# EAGLE design noisemaker_3-0 (EAGLE 6.4)
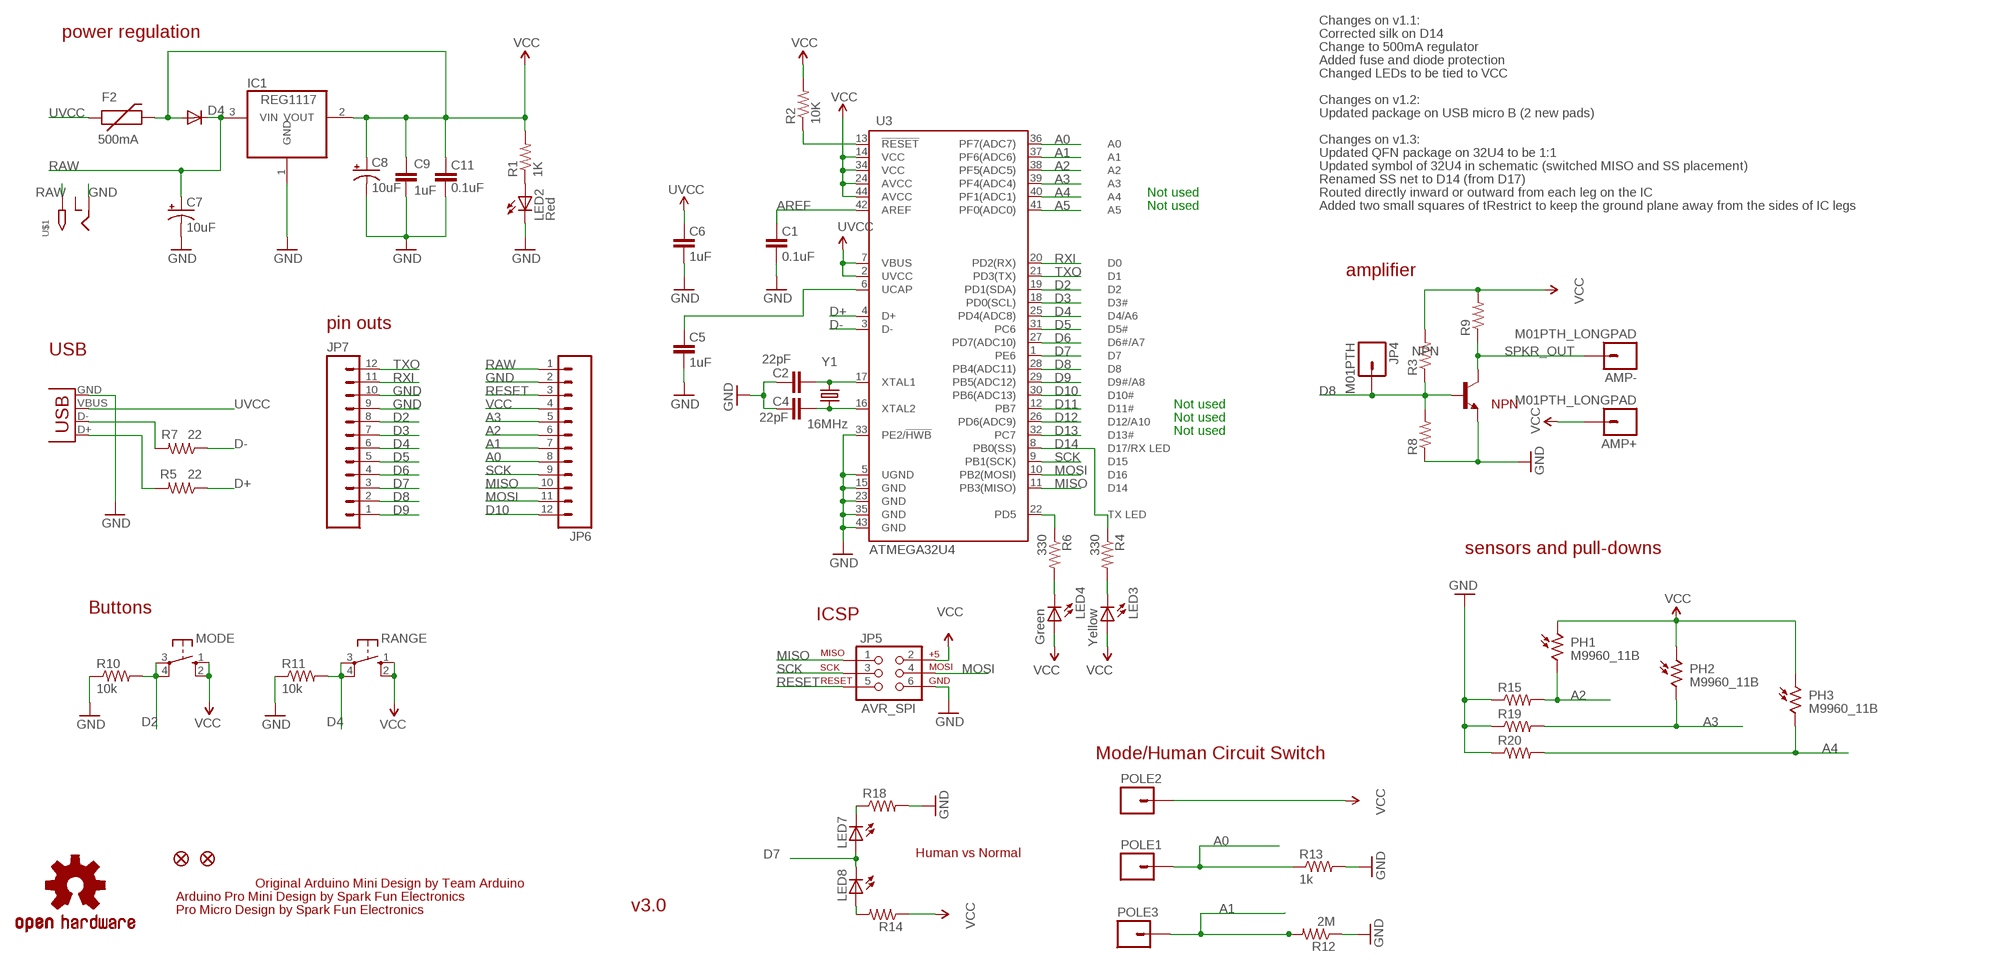
[diagram p0: schematic, sheet 1]

## Parts
AMP+  M01PTH_LONGPAD  [1X01_LONGPAD]
AMP-  M01PTH_LONGPAD  [1X01_LONGPAD]
C1  0.1uF  CAP1206  [1206]
C2  22pF  CAP0603-CAP  [0603-CAP]
C4  22pF  CAP0603-CAP  [0603-CAP]
C5  1uF  CAP1206  [1206]
C6  1uF  CAP1206  [1206]
C7  10uF  CAP_POL3528-KIT  [EIA3528-KIT]
C8  10uF  CAP_POL3528-KIT  [EIA3528-KIT]
C9  1uF  CAP1206  [1206]
C11  0.1uF  CAP1206  [1206]
D4  DIODESOD  [SOD-323]
F2  500mA  PTCSMD  [PTC-1206]
IC1  REG1117  [SOT223]
JP1  FIDUCIALUFIDUCIAL  [MICRO-FIDUCIAL]
JP2  FIDUCIALUFIDUCIAL  [MICRO-FIDUCIAL]
JP3  USB-B  USBPTH  [USB-B-PTH]
JP4  M01PTH  [1X01]
JP5  AVR_SPI  AVR_SPI_PRG_6PTH  [2X3]
JP6  M12PTH  [1X12]
JP7  M12PTH  [1X12]
LED2  Red  LEDCHIPLED_1206  [CHIPLED_1206]
LED3  Yellow  LEDCHIPLED_1206  [CHIPLED_1206]
LED4  Green  LEDCHIPLED_1206  [CHIPLED_1206]
LED7  LED3MM  [LED3MM]
LED8  LED3MM  [LED3MM]
MODE  10-XX  [B3F-10XX]
NPN  -NPN-TO220V  [TO220V]
PH1  M9960_11B  [M9960]
PH2  M9960_11B  [M9960]
PH3  M9960_11B  [M9960]
POLE1  M01PTH_LONGPAD  [1X01_LONGPAD]
POLE2  M01PTH_LONGPAD  [1X01_LONGPAD]
POLE3  M01PTH_LONGPAD  [1X01_LONGPAD]
R1  1K  RESISTOR1206  [1206]
R2  10K  RESISTOR1206  [1206]
R3  RESISTOR1206  [1206]
R4  330  RESISTOR1206  [1206]
R5  22  RESISTOR1206  [1206]
R6  330  RESISTOR1206  [1206]
R7  22  RESISTOR1206  [1206]
R8  RESISTOR1206  [1206]
R9  RESISTOR1206  [1206]
R10  10k  RESISTOR1206  [1206]
R11  10k  RESISTOR1206  [1206]
R12  2M  RESISTOR1206  [1206]
R13  1k  RESISTOR1206  [1206]
R14  RESISTOR1206  [1206]
R15  RESISTOR1206  [1206]
R18  RESISTOR1206  [1206]
R19  RESISTOR1206  [1206]
R20  RESISTOR1206  [1206]
RANGE  10-XX  [B3F-10XX]
U3  ATMEGA32U4  ATMEGA32U4TQFP  [SPARKFUN-DIGITALIC_TQFP44]
U$1  2.1MMJACKTHM  [PJ-102A]
U$3  OSHW-LOGOS  [OSHW-LOGO-S]
Y1  16MHz  CRYSTAL5X3  [CRYSTAL-SMD-5X3]

## Nets
A0: JP6.8 POLE1.1 R13.1 U3.36(PF7(ADC7))
A1: JP6.7 POLE3.1 R12.2 U3.37(PF6(ADC6))
A2: JP6.6 PH1.2 R15.2 U3.38(PF5(ADC5))
A3: JP6.5 PH2.2 R19.2 U3.39(PF4(ADC4))
A4: PH3.2 R20.2 U3.40(PF1(ADC1))
A5: U3.41(PF0(ADC0))
AREF: C1.2 U3.42(AREF)
D2: JP7.8 MODE.3(P) MODE.4(P1) R10.2 U3.19(PD1(SDA))
D3: JP7.7 U3.18(PD0(SCL))
D4: JP7.6 R11.2 RANGE.3(P) RANGE.4(P1) U3.25(PD4(ADC8))
D5: JP7.5 U3.31(PC6)
D6: JP7.4 U3.27(PD7(ADC10))
D7: JP7.3 LED7.A LED8.K(C) U3.1(PE6)
D8: JP4.1 JP7.2 NPN.1(B) R3.1 R8.2 U3.28(PB4(ADC11))
D9: JP7.1 U3.29(PB5(ADC12))
D10: JP6.12 U3.30(PB6(ADC13))
D11: U3.12(PB7)
D12: U3.26(PD6(ADC9))
D13: U3.32(PC7)
D14: R4.1 U3.8(PB0(SS))
D+: R5.1 U3.4(D+)
D-: R7.1 U3.3(D-)
GND [vcc]: C1.1 C2.2 C4.2 C5.1 C6.1 C7.C(-) C8.C(-) C9.2 C11.1 IC1.1(GND) JP3.GND JP5.6 JP6.2 JP7.9 JP7.10 LED2.C NPN.3(E) R8.1 R10.1 R11.1 R12.1 R13.2 R15.1 R18.2 R19.1 R20.1 U3.5(UGND) U3.15(GND) U3.23(GND) U3.33(PE2/!HWB) U3.35(GND) U3.43(GND) U$1.RING
MISO: JP5.1 JP6.10 U3.11(PB3(MISO))
MOSI: JP5.4 JP6.11 U3.10(PB2(MOSI))
N$1: C4.1 U3.16(XTAL2) Y1.1
N$2: C2.1 U3.17(XTAL1) Y1.3
N$4: C5.2 U3.6(UCAP)
N$5: LED3.C R4.2
N$7: LED4.C R6.2
N$8: JP3.D+ R5.2
N$9: JP3.D- R7.2
N$10: LED2.A R1.1
N$12: LED7.K(C) R18.1
N$13: LED8.A R14.2
RAW [vcc]: C7.A(+) D4.1(C) IC1.3(VIN) JP6.1 U$1.TIP
RESET: JP5.5 JP6.3 R2.1 U3.13(!RESET)
RXI: JP7.11 U3.20(PD2(RX))
SCK: JP5.3 JP6.9 U3.9(PB1(SCK))
SPKR_OUT: AMP-.1 NPN.2(C) R9.1
TXLED: R6.1 U3.22(PD5)
TXO: JP7.12 U3.21(PD3(TX))
UVCC: C6.2 F2.1 JP3.VBUS U3.2(UVCC) U3.7(VBUS)
VCC: AMP+.1 C8.A(+) C9.1 C11.2 D4.2(A) F2.2 IC1.2(VOUT) JP5.2 JP6.4 LED3.A LED4.A MODE.1(S) MODE.2(S1) PH1.1 PH2.1 PH3.1 POLE2.1 R1.2 R2.2 R3.2 R9.2 R14.1 RANGE.1(S) RANGE.2(S1) U3.14(VCC) U3.24(AVCC) U3.34(VCC) U3.44(AVCC)
Unconnected: U$1.RING_SW

## Notes on the sheet
- Changes on v1.1:
- power regulation | Corrected silk on D14
- Change to 500mA regulator
- Added fuse and diode protection
- Changed LEDs to be tied to VCC
- Changes on v1.2:
- Updated package on USB micro B (2 new pads)
- Changes on v1.3:
- Updated QFN package on 32U4 to be 1:1
- Updated symbol of 32U4 in schematic (switched MISO and SS placement)
- Renamed SS net to D14 (from D17)
- Not used | Routed directly inward or outward from each leg on the IC
- Not used | Added two small squares of tRestrict to keep the ground plane away from the sides of IC legs
- amplifier
- pin outs
- USB
- Not used | NPN
- Not used
- Not used
- sensors and pull-downs
- Buttons
- ICSP
- Mode/Human Circuit Switch
- Human vs Normal
- Original Arduino Mini Design by Team Arduino
- Arduino Pro Mini Design by Spark Fun Electronics
- Pro Micro Design by Spark Fun Electronics | v3.0

## Library data of the parts
AMP+ AMP- JP4 POLE1-POLE3 = SparkFun-Connectors:M01: Header 1 Standard 1-pin 0.1" header. Use with straight break away headers (SKU : PRT-00116), right angle break away headers (PRT-00553), swiss pins (PRT-00743), machine pins (PRT-00117), and female headers (PRT-00115).
C1 C5 C6 C9 C11 = SparkFun-Capacitors:CAP: Capacitor Standard 0603 ceramic capacitor, and 0.1" leaded capacitor.
C2 C4 = SparkFun:CAP: Capacitor Standard 0603 ceramic capacitor, and 0.1" leaded capacitor.
C7 C8 = SparkFun-Capacitors:CAP_POL: Capacitor Polarized These are standard SMD and PTH capacitors. Normally 10uF, 47uF, and 100uF in electrolytic and tantalum varieties. Always verify the external diameter of the through hole cap, it varies with capacity, voltage, and manufacturer. The EIA devices should be standard.
D4 = SparkFun:DIODE: Diode These are standard reverse protection diodes and small signal diodes. SMA package can handle up to about 1A. SOD-323 can handle about 200mA. What the SOD-323 package when ordering, there are some mfgs out there that are 5-pin packages.
F2 = SparkFun:PTC: Resettable Fuse PTC Resettable Fuse. Spark Fun Electronics SKU : COM-08357
IC1 = burr-brown:REG1117: 800mA and 1A Low Dropout (LDO) Positive Regulator 1.8V, 2.5V, 2.85V, 3.3V, 5V, and Adj; MPN: REG1117; OC_FARNELL: 1097566; OC_NEWARK: 14P6981
JP1 JP2 = SparkFun:FIDUCIAL: Fiducial Alignment Points Various fiducial points for machine vision alignment.
JP3 = SparkFun-Connectors:USB: USB Connectors USB-B-PTH is fully proven SKU : PRT-00139/CONN-08278 USB-miniB is fully proven SKU : PRT-00587 USB-A-PCB is untested. USB-A-H is throughly reviewed, but untested. Spark Fun Electronics SKU : PRT-00437 USB-B-SMT is throughly reviewed, but untested. Needs silkscreen touching up. USB-A-S has not been used/tested USB-MB-H has not been used/tested USB-MICROB has been used. CONN-09505; PROD_ID: CONN-08278
JP5 = SparkFun:AVR_SPI_PRG_6: AVR ISP 6 Pin This is the reduced ISP connector for AVR programming. Common on Arduino. This footprint will take up less PCB space and can be used with a 10-pin to 6-pin adapter such as SKU: BOB-08508
JP6 JP7 = SparkFun:M12: Header 12 Standard 12-pin 0.1" header. Use with straight break away headers (SKU : PRT-00116), right angle break away headers (PRT-00553), swiss pins (PRT-00743), machine pins (PRT-00117), and female headers (PRT-00115).
LED2-LED4 LED7 LED8 = adafruit:LED: LED OSRAM: - CHIPLED LG R971, LG N971, LY N971, LG Q971, LY Q971, LO R971, LY R971 LH N974, LH R974 LS Q976, LO Q976, LY Q976 LO Q996 - Hyper CHIPLED LW Q18S LB Q993, LB Q99A, LB R99A - SideLED LS A670, LO A670, LY A670, LG A670, LP A670 LB A673, LV A673, LT A673, LW A673 LH A674 LY A675 LS A676, LA A676, LO A676, LY A676, LW A676 LS A679, LY A679, LG A679 - Hyper Micro SIDELED® LS Y876, LA Y876, LO Y876, LY Y876 LT Y87S - SmartLED LW L88C, LW L88S LB L89C, LB L89S, LG L890 LS L89K, LO L89K, LY L89K LS L896, LA L896, LO L896, LY L896 - TOPLED LS T670, LO T670, LY T670, LG T670, LP T670 LSG T670, LSP T670, LSY T670, LOP T670, LYG T670 LG T671, LOG T671, LSG T671 LB T673, LV T673, LT T673, LW T673 LH T674 LS T676, LA T676, LO T676, LY T676, LB T676, LH T676, LSB T676, LW T676 LB T67C, LV T67C, LT T67C, LS T67K, LO T67K, LY T67K, LW E67C LS E67B, LA E67B, LO E67B, LY E67B, LB E67C, LV E67C, LT E67C LW T67C LS T679, LY T679, LG T679 LS T770, LO T770, LY T770, LG T770, LP T770 LB T773, LV T773, LT T773, LW T773 LH T774 LS E675, LA E675, LY E675, LS T675 LS T776, LA T776, LO T776, LY T776, LB T776 LHGB T686 LT T68C, LB T68C - Hyper Mini TOPLED® LB M676 - Mini TOPLED Santana® LG M470 LS M47K, LO M47K, LY M47K Source: http://www.osram.convergy.de/
MODE RANGE = switch-omron:10-XX: OMRON SWITCH
NPN = transistor:*-NPN-: NPN Transistror BF959 corrected 2008.03.06
PH1-PH3 = photo-elements:M9960_11: Photo Sensor Beacon Light, Photometer Applications Source: http://optoelectronics.perkinelmer.com/content/Datasheets/DTS_M9960.pdf
R1-R15 R18-R20 = SparkFun-Passives:RESISTOR: Resistor Basic schematic elements and footprints for 0603, 1206, and PTH resistors.
U3 = SparkFun-DigitalIC:ATMEGA32U4: Atmel 44-pin 8-bit Microcontroller with 32KBytes of ISP Flash and USB Controller
U$1 = adafruit:2.1MMJACK: 2.1mm x 5.5mm THM DC jack with internal switch. Digikey part #PJ-102A, 4UCON part #05537 2.1mm x 5.5mm SMT DC jack with internal switch. Digikey part #PJ-002A-SMT, 4UCON part #03267 By microbuilder.eu & adafruit.com
U$3 = SparkFun:OSHW-LOGO: Open Source Hardware Logo This logo indicates the piece of hardware it is found on incorporates a OSHW license and/or adheres to the definition of open source hardware found here: http://freedomdefined.org/OSHW
Y1 = SparkFun:CRYSTAL: Crystals Various standard crystals. Proven footprints. Spark Fun Electronics SKU : COM-00534

## Net classes
0 default: width 0.203 mm

## Board
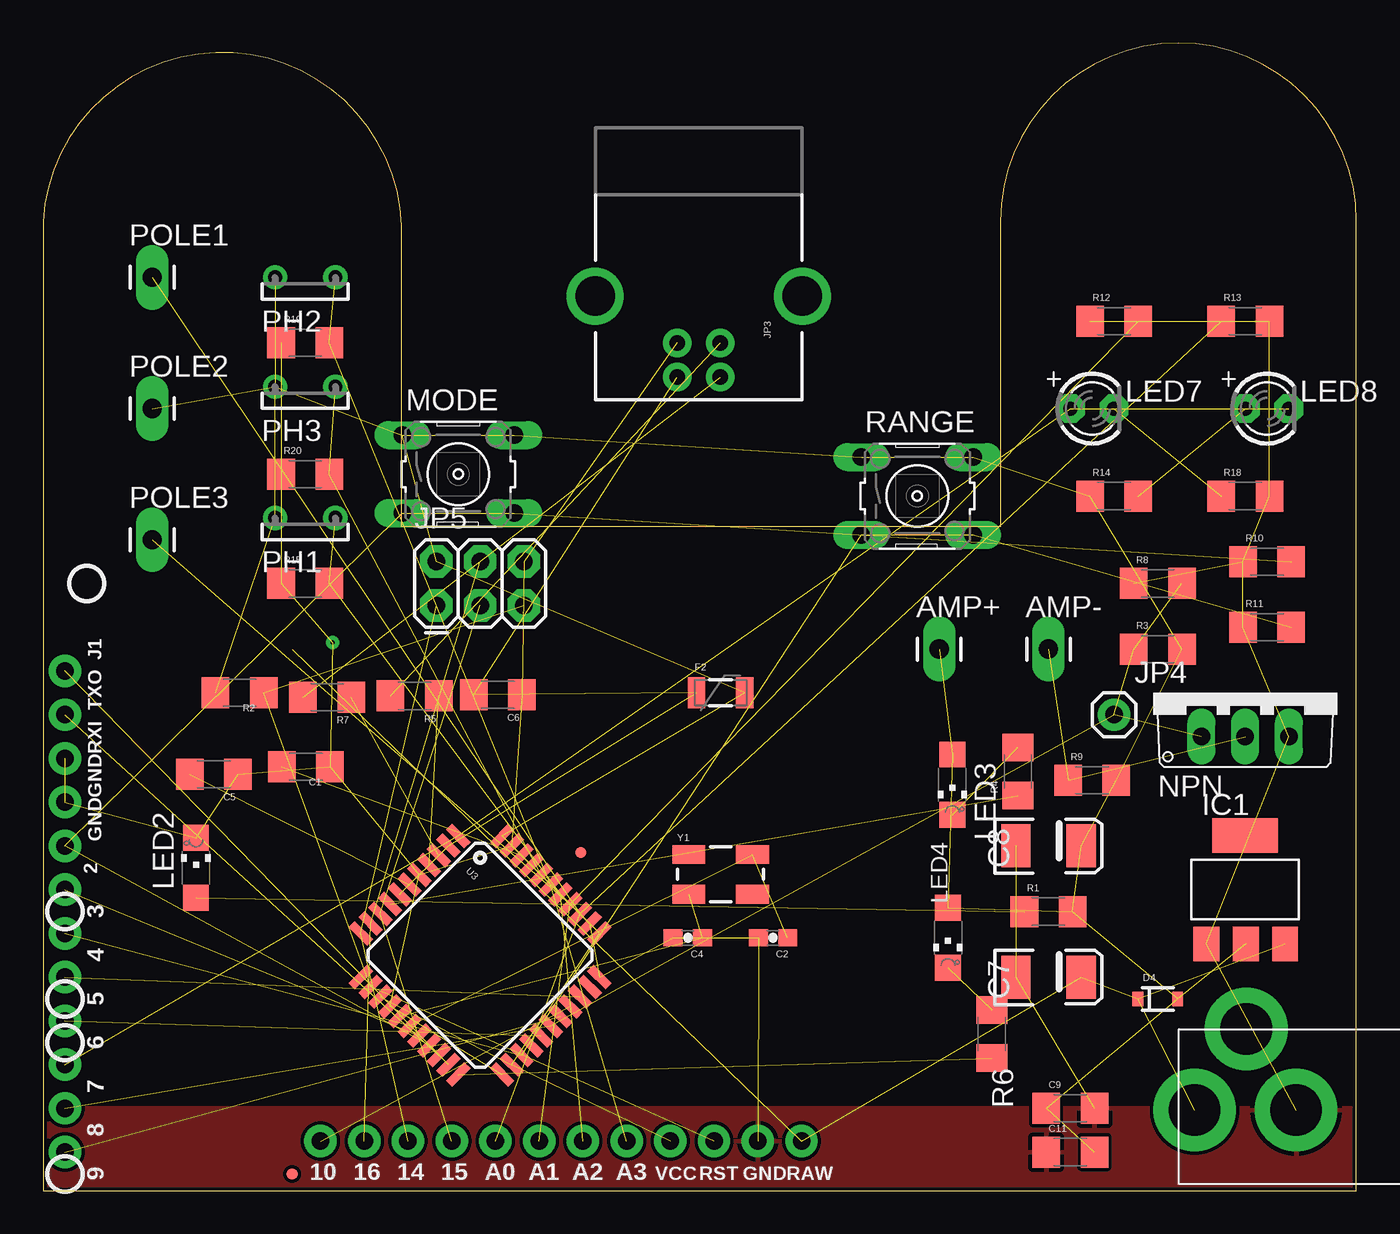
[diagram p1: board, top side]
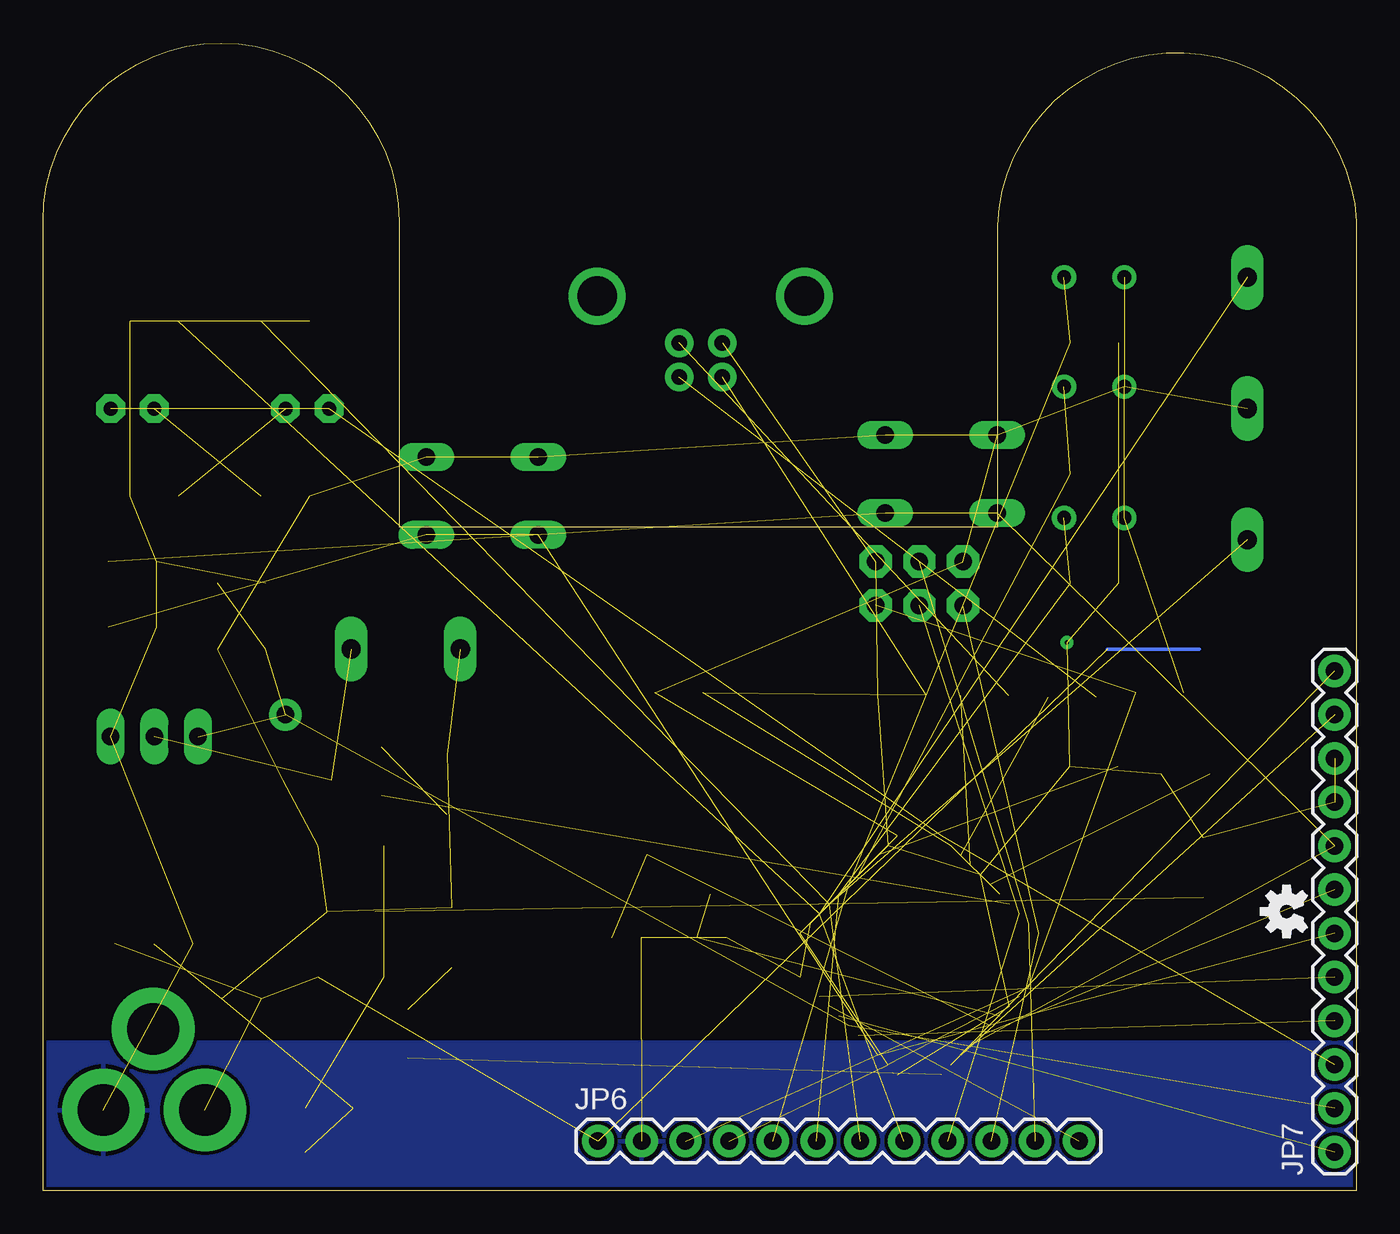
[diagram p2: board, bottom side, seen from below]

Size 76.31 x 66.66 mm. Coordinates in mm from the lower left corner, seen from the top.
Outline: 0,0 76.31,0 76.31,56.31 arc180 55.62,56.31 55.62,38.57 20.82,38.57 20.82,55.04 arc180 0,56.31 0,0
Copper layers (1*16): Top 0.035mm / dielectric 1.5mm / Bottom 0.035mm
Design rules "SparkFun *": minimum track width 8mil, minimum drill 15mil, track to track 7mil, track to pad 7mil, pad to pad 7mil, via to via 7mil, smd to smd 7mil, copper to edge 7mil, drill to drill 7mil, minimum pad ring 12mil, minimum via ring 10mil, stop-mask expansion 4mil, vias tented up to drill 20mil, thermal gap 10mil
tRestrict: area 9.1,9.3 to 9.3,9.4; area 13.1,13.3 to 13.1,13.4; area 5.4,10 to 12.6,17.3

### Footprints (pad centres in the part's own frame; a part is rotated, then mirrored left to right if it is on the bottom)
1X01_LONGPAD = drill 1.118 pad 1.88 long: 1 0,0
1206 = smd 1.6 x 1.8: 1 -1.4,0; 2 1.4,0
0603-CAP = smd 1.1 x 1: 1 -0.85,0; 2 0.85,0
EIA3528-KIT = smd 1.7 x 2.5: A 1.9,0; C -1.9,0
SOD-323 = smd 0.63 x 0.83: 1 -1.15,0; 2 1.15,0
PTC-1206 = smd 1 x 1.8: 1 -1.4,0; 2 1.4,0
SOT223 = smd 1.499 x 2.007: 1 -2.261,-3.15; 2 0.025,-3.15; 3 2.311,-3.15 | smd 3.81 x 2.007: 4 0,3.15
MICRO-FIDUCIAL = smd 0.635 x 0.635: 1 0,0
USB-B-PTH = drill 0.914 pad 1.676: D+ 0,1.25; D- 1.981,1.25; GND 0,-1.25; VBUS 1.981,-1.25 | drill 2.286: S1 -2.718,-6.02; S2 -2.718,6.02
1X01 = drill 1.016 pad 1.88: 1 0,0
2X3 = drill 1.016 pad 1.88 octagon: 1 0,0; 2 0,2.54; 3 2.54,0; 4 2.54,2.54; 5 5.08,0; 6 5.08,2.54
1X12 = drill 1.016 pad 1.88: 1 0,0; 2 2.54,0; 3 5.08,0; 4 7.62,0; 5 10.16,0; 6 12.7,0; 7 15.24,0; 8 17.78,0; 9 20.32,0; 10 22.86,0; 11 25.4,0; 12 27.94,0
CHIPLED_1206 = smd 1.5 x 1.5: A 0,-1.75; C 0,1.75
LED3MM = drill 0.813 pad 1.676 octagon: A -1.27,0; K 1.27,0
B3F-10XX = drill 1.016 long: 1 -3.251,2.261; 2 3.251,2.261; 3 -3.251,-2.261; 4 3.251,-2.261
TO220V = drill 1.016 long: 1 -2.54,-2.54; 2 0,-2.54; 3 2.54,-2.54
M9960 = drill 0.8 pad 1.4: 1 -1.75,0; 2 1.75,0
SPARKFUN-DIGITALIC_TQFP44 = smd 1.5 x 0.5: 1 -5.8,4; 2 -5.8,3.2; 3 -5.8,2.4; 4 -5.8,1.6; 5 -5.8,0.8; 6 -5.8,0; 7 -5.8,-0.8; 8 -5.8,-1.6; 9 -5.8,-2.4; 10 -5.8,-3.2; 11 -5.8,-4; 23 5.8,-4; 24 5.8,-3.2; 25 5.8,-2.4; 26 5.8,-1.6; 27 5.8,-0.8; 28 5.8,0; 29 5.8,0.8; 30 5.8,1.6; 31 5.8,2.4; 32 5.8,3.2; 33 5.8,4 | smd 0.5 x 1.5: 12 -4,-5.8; 13 -3.2,-5.8; 14 -2.4,-5.8; 15 -1.6,-5.8; 16 -0.8,-5.8; 17 0,-5.8; 18 0.8,-5.8; 19 1.6,-5.8; 20 2.4,-5.8; 21 3.2,-5.8; 22 4,-5.8; 34 4,5.8; 35 3.2,5.8; 36 2.4,5.8; 37 1.6,5.8; 38 0.8,5.8; 39 0,5.8; 40 -0.8,5.8; 41 -1.6,5.8; 42 -2.4,5.8; 43 -3.2,5.8; 44 -4,5.8
PJ-102A = drill 3 pad 4.8: RING 0.1,-3.39; RING_SW -4.6,-6.29; TIP 0.1,-9.29
CRYSTAL-SMD-5X3 = smd 1.9 x 1.1: 1 -1.85,-1.15; 2 1.85,-1.15; 3 1.85,1.15; 4 -1.85,1.15

### Placement (x,y rotation side)
AMP+  52.06,31.46 0 top
AMP-  58.41,31.46 0 top
C1  15.27,24.62 180 top
C2  42.41,14.69 180 top
C4  37.46,14.69 180 top
C5  9.93,24.19 180 top
C6  26.42,28.81 180 top
C7  58.41,12.41 0 top
C8  58.41,20.03 0 top
C9  59.68,4.79 0 top
C11  59.68,2.25 0 top
D4  64.77,11.14 0 top
F2  39.36,28.92 0 top
IC1  69.84,17.49 0 top
JP1  31.24,19.65 0 top
JP2  14.47,0.98 0 top
JP3  38.09,49.24 270 top
JP4  62.22,27.65 0 top
JP5  22.86,34 0 top
JP6  44.06,2.88 0 bottom
JP7  1.27,2.25 90 bottom
LED2  8.88,18.76 0 top
LED3  52.83,23.58 180 top
LED4  52.57,14.69 180 top
LED7  60.95,45.43 0 top
LED8  71.12,45.43 0 top
MODE  24.12,41.62 0 top
NPN  69.84,28.92 0 top
PH1  15.23,39.08 0 top
PH2  15.23,53.05 0 top
PH3  15.23,46.7 0 top
POLE1  6.34,53.05 0 top
POLE2  6.34,45.43 0 top
POLE3  6.34,37.81 0 top
R1  58.41,16.22 0 top
R2  11.42,28.92 180 top
R3  64.77,31.46 0 top
R4  56.64,24.35 90 top
R5  21.59,28.74 180 top
R6  55.11,9.11 90 top
R7  16.51,28.66 180 top
R8  64.77,35.27 0 top
R9  60.95,23.84 0 top
R10  71.12,36.54 0 top
R11  71.12,32.73 0 top
R12  62.22,50.51 0 top
R13  69.84,50.51 0 top
R14  62.22,40.35 0 top
R15  15.23,35.27 0 top
R18  69.84,40.35 0 top
R19  15.23,49.24 0 top
R20  15.23,41.62 0 top
RANGE  50.79,40.35 0 top
U3  25.39,13.68 315 top
U$1  76.2,4.79 270 top
U$3  4.06,16.22 90 bottom
Y1  39.36,18.38 0 top

### Tracks (layer width: path | path; a pad name or v marks a point on that pad's centre or on a via)
A0  (3 unrouted)
A1  (3 unrouted)
A2  (3 unrouted)
A3  (3 unrouted)
A4  (2 unrouted)
AREF  (1 unrouted)
D2  (4 unrouted)
D3  (1 unrouted)
D4  (4 unrouted)
D5  (1 unrouted)
D6  (1 unrouted)
D7  (3 unrouted)
D8  (5 unrouted)
D9  (1 unrouted)
D10  (1 unrouted)
D14  (1 unrouted)
D+  (1 unrouted)
D-  (1 unrouted)
GND  (via drill 0.25)  (30 unrouted)
  other vias: 16.82,31.84
  pour Top (isolate 0.203): -0.01,4.79 95.25,4.79 95.25,-0.29 -0.01,-0.29
  pour Bottom (isolate 0.203): -0.01,8.6 97.79,8.6 97.79,-0.29 -0.01,-0.29
MISO  (2 unrouted)
MOSI  (2 unrouted)
N$1  (2 unrouted)
N$2  (2 unrouted)
N$4  (1 unrouted)
N$5  (1 unrouted)
N$7  (1 unrouted)
N$8  (1 unrouted)
N$9  (1 unrouted)
N$10  (1 unrouted)
N$12  (1 unrouted)
N$13  (1 unrouted)
RAW  (5 unrouted)
  Bottom 0.203: 9.14,31.46 14.47,31.46
RESET  (3 unrouted)
RXI  (1 unrouted)
SCK  (2 unrouted)
SPKR_OUT  (2 unrouted)
TXLED  (1 unrouted)
TXO  (1 unrouted)
UVCC  (4 unrouted)
VCC  (27 unrouted)

### Text on the board
tPlace: J1 | TXO | RXI | GND | GND | 2 | 3 | 4 | 5 | 6 | 7 | 8 | 9 | 10 | 16 | 14 | 15 | A0 | A1 | A2 | A3 | VCC | RST | GND | RAW
tValues: Valid combinations: | 3.3V Reg / 8MHz | 5V Reg / 16MHz | Mark back accordingly